# Altium schematic sheet mainboard_interface.v1.0.SchDoc
size A4
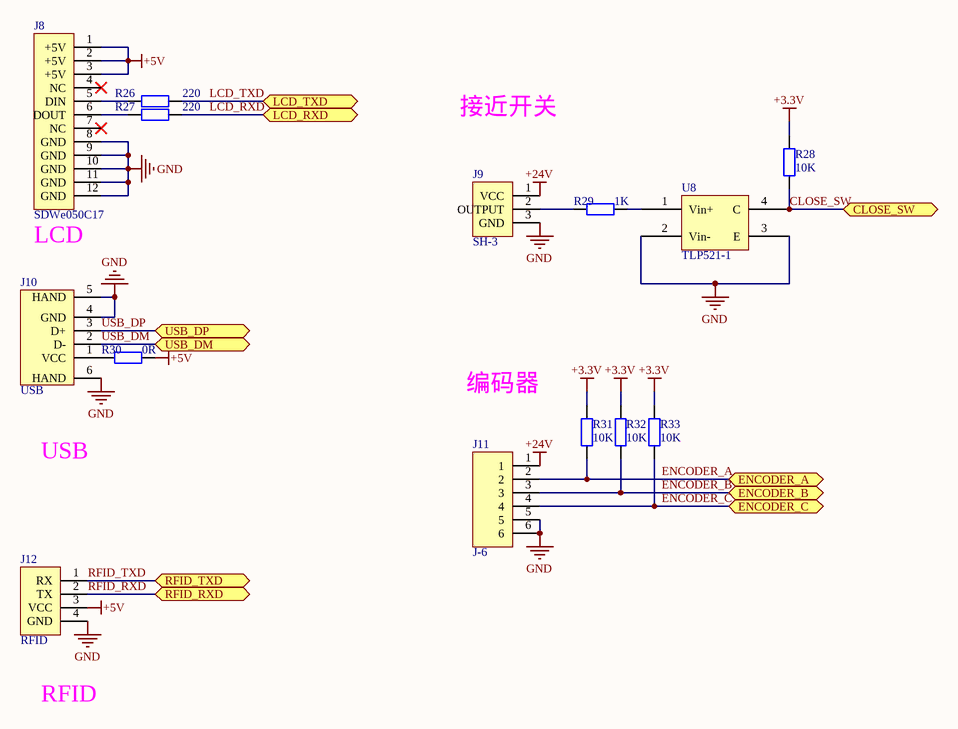
[diagram p0: mainboard_interface.v1.0.SchDoc]

## Parts
J8  SDWe050C17  [FCC1.0-10]
J9  SH-3  [PH2.0-3T]
J10  USB  [USB_FEMALE_A]
J11  J-6  [PH2.0-6P]
J12  RFID  [J254-4]
R26  220  [0805]
R27  220  [0805]
R28  10K  [0805]
R29  1K  [0805]
R30  0R  [0805]
R31  10K  [0805]
R32  10K  [0805]
R33  10K  [0805]
U8  TLP521-1  [DIP-4]

## Ports
CLOSE_SW, ENCODER_A, ENCODER_B, ENCODER_C, LCD_RXD, LCD_TXD, RFID_RXD, RFID_TXD, USB_DM, USB_DP

## Nets
+3.3V: R28.1 R31.1 R32.1 R33.1
+5V: J8.1(+5V) J8.2(+5V) J8.3(+5V) J12.3(VCC) R30.1
+24V: J9.1(VCC) J11.1
GND: J8.8(GND) J8.9(GND) J8.10(GND) J8.11(GND) J8.12(GND) J9.3(GND) J10.4(GND) J10.5(HAND) J10.6(HAND) J11.5 J11.6 J12.4(GND) U8.2(Vin-) U8.3(E)
CLOSE_SW: R28.2 U8.4(C) ; port CLOSE_SW
ENCODER_A: J11.2 R31.2 ; port ENCODER_A
ENCODER_B: J11.3 R32.2 ; port ENCODER_B
ENCODER_C: J11.4 R33.2 ; port ENCODER_C
LCD_RXD: R27.2 ; port LCD_RXD
LCD_TXD: R26.2 ; port LCD_TXD
RFID_RXD: J12.2(TX) ; port RFID_RXD
RFID_TXD: J12.1(RX) ; port RFID_TXD
USB_DM: J10.2(D-) ; port USB_DM
USB_DP: J10.3(D+) ; port USB_DP
NetJ8_5: J8.5(DIN) R26.1
NetJ8_6: J8.6(DOUT) R27.1
NetJ9_2: J9.2(OUTPUT) R29.2
NetJ10_1: J10.1(VCC) R30.2
NetR29_1: R29.1 U8.1(Vin+)

Not connected (* = marked no-connect by the designer): J8 4(NC)* 7(NC)*

## Notes on the sheet
- 接近开关
- (near J8) LCD
- 编码器
- USB
- RFID

## Library data of the parts
J8 = SH-12
J11 = SH-6
J12 = SH-4
R26-R28 R30-R33 = Res2: Resistor; Value: 1K; Published: 8-Jun-2000; LatestRevisionDate: 17-Jul-2002; LatestRevisionNote: Re-released for DXP Platform.; PackageReference: AXIAL-0.4; Publisher: Altium Limited
R29 = Res2: Resistor; Published: 8-Jun-2000; LatestRevisionDate: 17-Jul-2002; LatestRevisionNote: Re-released for DXP Platform.; PackageReference: AXIAL-0.4; Publisher: Altium Limited; Value: 1K